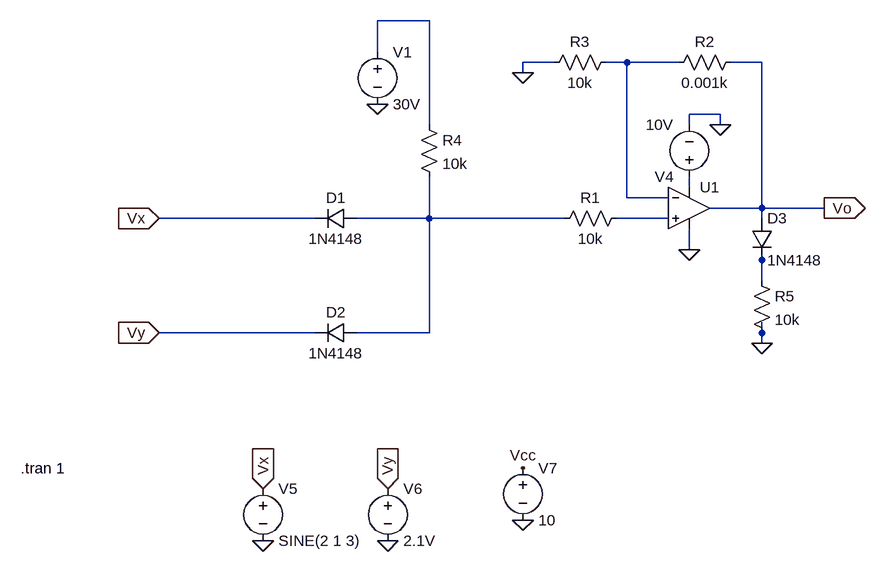
[diagram p0: schematic min.asc]
min.asc, the LTspice schematic file:
Version 4
SHEET 1 880 692
WIRE -128 -128 -208 -128
WIRE -208 -80 -208 -128
WIRE 64 -64 16 -64
WIRE 176 -64 144 -64
WIRE 256 -64 176 -64
WIRE 384 -64 336 -64
WIRE 16 -48 16 -64
WIRE 320 16 272 16
WIRE -128 32 -128 -128
WIRE 272 32 272 16
WIRE 320 32 320 16
WIRE 272 128 272 112
WIRE 176 144 176 -64
WIRE 240 144 176 144
WIRE 384 160 384 -64
WIRE 384 160 304 160
WIRE 480 160 384 160
WIRE -304 176 -544 176
WIRE -128 176 -128 112
WIRE -128 176 -240 176
WIRE 80 176 -128 176
WIRE 240 176 160 176
WIRE 384 176 384 160
WIRE 272 224 272 192
WIRE 384 240 384 224
WIRE 384 272 384 240
WIRE -304 352 -544 352
WIRE -128 352 -128 176
WIRE -128 352 -240 352
WIRE 384 352 384 336
WIRE 384 368 384 352
FLAG -208 0 0
FLAG 320 32 0
FLAG 16 -48 0
FLAG 384 368 0
FLAG 480 160 Vo
IOPIN 480 160 Out
FLAG 272 224 0
FLAG -544 176 Vx
IOPIN -544 176 In
FLAG -544 352 Vy
IOPIN -544 352 In
FLAG -192 592 Vy
IOPIN -192 592 In
FLAG -384 592 Vx
IOPIN -384 592 In
FLAG 16 560 Vcc
FLAG 16 640 0
FLAG -384 672 0
FLAG -192 672 0
SYMBOL OpAmps\\UniversalOpamp 272 160 R0
SYMATTR InstName U1
SYMBOL voltage -208 -96 R0
WINDOW 123 0 0 Left 0
WINDOW 39 0 0 Left 0
SYMATTR InstName V1
SYMATTR Value 30V
SYMBOL voltage 272 128 R180
WINDOW 123 0 0 Left 0
WINDOW 39 0 0 Left 0
SYMATTR InstName V4
SYMATTR Value 10V
SYMBOL res 176 160 R90
WINDOW 0 0 56 VBottom 2
WINDOW 3 32 56 VTop 2
SYMATTR InstName R1
SYMATTR Value 10k
SYMBOL res 352 -80 R90
WINDOW 0 0 56 VBottom 2
WINDOW 3 32 56 VTop 2
SYMATTR InstName R2
SYMATTR Value 0.001k
SYMBOL res 160 -80 R90
WINDOW 0 0 56 VBottom 2
WINDOW 3 32 56 VTop 2
SYMATTR InstName R3
SYMATTR Value 10k
SYMBOL diode -240 160 R90
WINDOW 0 0 32 VBottom 2
WINDOW 3 32 32 VTop 2
SYMATTR InstName D1
SYMATTR Value 1N4148
SYMBOL diode -240 336 R90
WINDOW 0 0 32 VBottom 2
WINDOW 3 32 32 VTop 2
SYMATTR InstName D2
SYMATTR Value 1N4148
SYMBOL res -144 16 R0
SYMATTR InstName R4
SYMATTR Value 10k
SYMBOL diode 368 176 R0
SYMATTR InstName D3
SYMATTR Value 1N4148
SYMBOL res 368 256 R0
SYMATTR InstName R5
SYMATTR Value 10k
SYMBOL voltage -384 576 R0
WINDOW 123 0 0 Left 0
WINDOW 39 0 0 Left 0
SYMATTR InstName V5
SYMATTR Value SINE(2 1 3)
SYMBOL voltage -192 576 R0
WINDOW 123 0 0 Left 0
WINDOW 39 0 0 Left 0
SYMATTR InstName V6
SYMATTR Value 2.1V
SYMBOL voltage 16 544 R0
WINDOW 123 0 0 Left 0
WINDOW 39 0 0 Left 0
SYMATTR InstName V7
SYMATTR Value 10
TEXT -688 560 Right 2 !.tran 1

The netlist it stands for:
* min.asc
XU1 N005 N002 N003 0 Vo level1 Avol=1Meg GBW=10Meg Vos=0 En=0 Enk=0 In=0 Ink=0 Rin=500Meg  ; pins In+ In- V+ V- OUT
V1 N001 0 30V
V4 N003 0 10V
R1 N005 N004 10k
R2 Vo N002 0.001k
R3 N002 0 10k
D1 N004 Vx 1N4148
D2 N004 Vy 1N4148
R4 N001 N004 10k
D3 Vo N006 1N4148
R5 N006 0 10k
V5 Vx 0 SINE(2 1 3)
V6 Vy 0 2.1V
V7 Vcc 0 10
.model D D
.lib standard.dio
.tran 1
.lib UniversalOpAmp1.lib
.backanno
.end

* Results of the author's LTspice run, read from the files saved beside the schematic
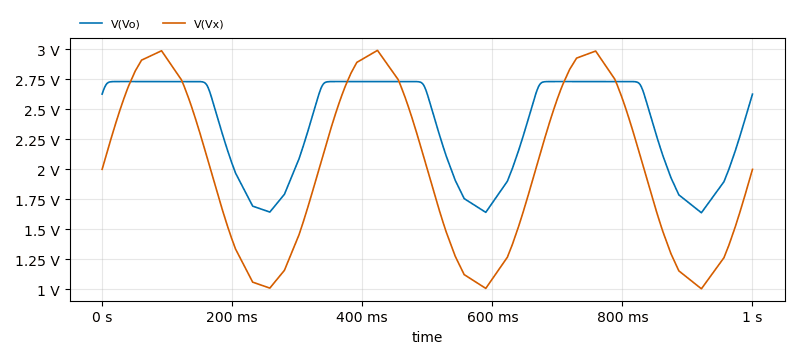
[diagram p1: Transient Analysis of min.asc, plotted from the saved traces]
* Transient Analysis, 1 run:
*   V(Vo): min 1.638 V, max 2.731 V, average 2.367 V, rms 2.404 V, last 2.627 V
*   V(Vx): min 1.005 V, max 2.991 V, average 2.001 V, rms 2.118 V, last 2 V